# EAGLE schematic electrobassrev7_fix (EAGLE 9.6.2)

## Sheet 1 of 10
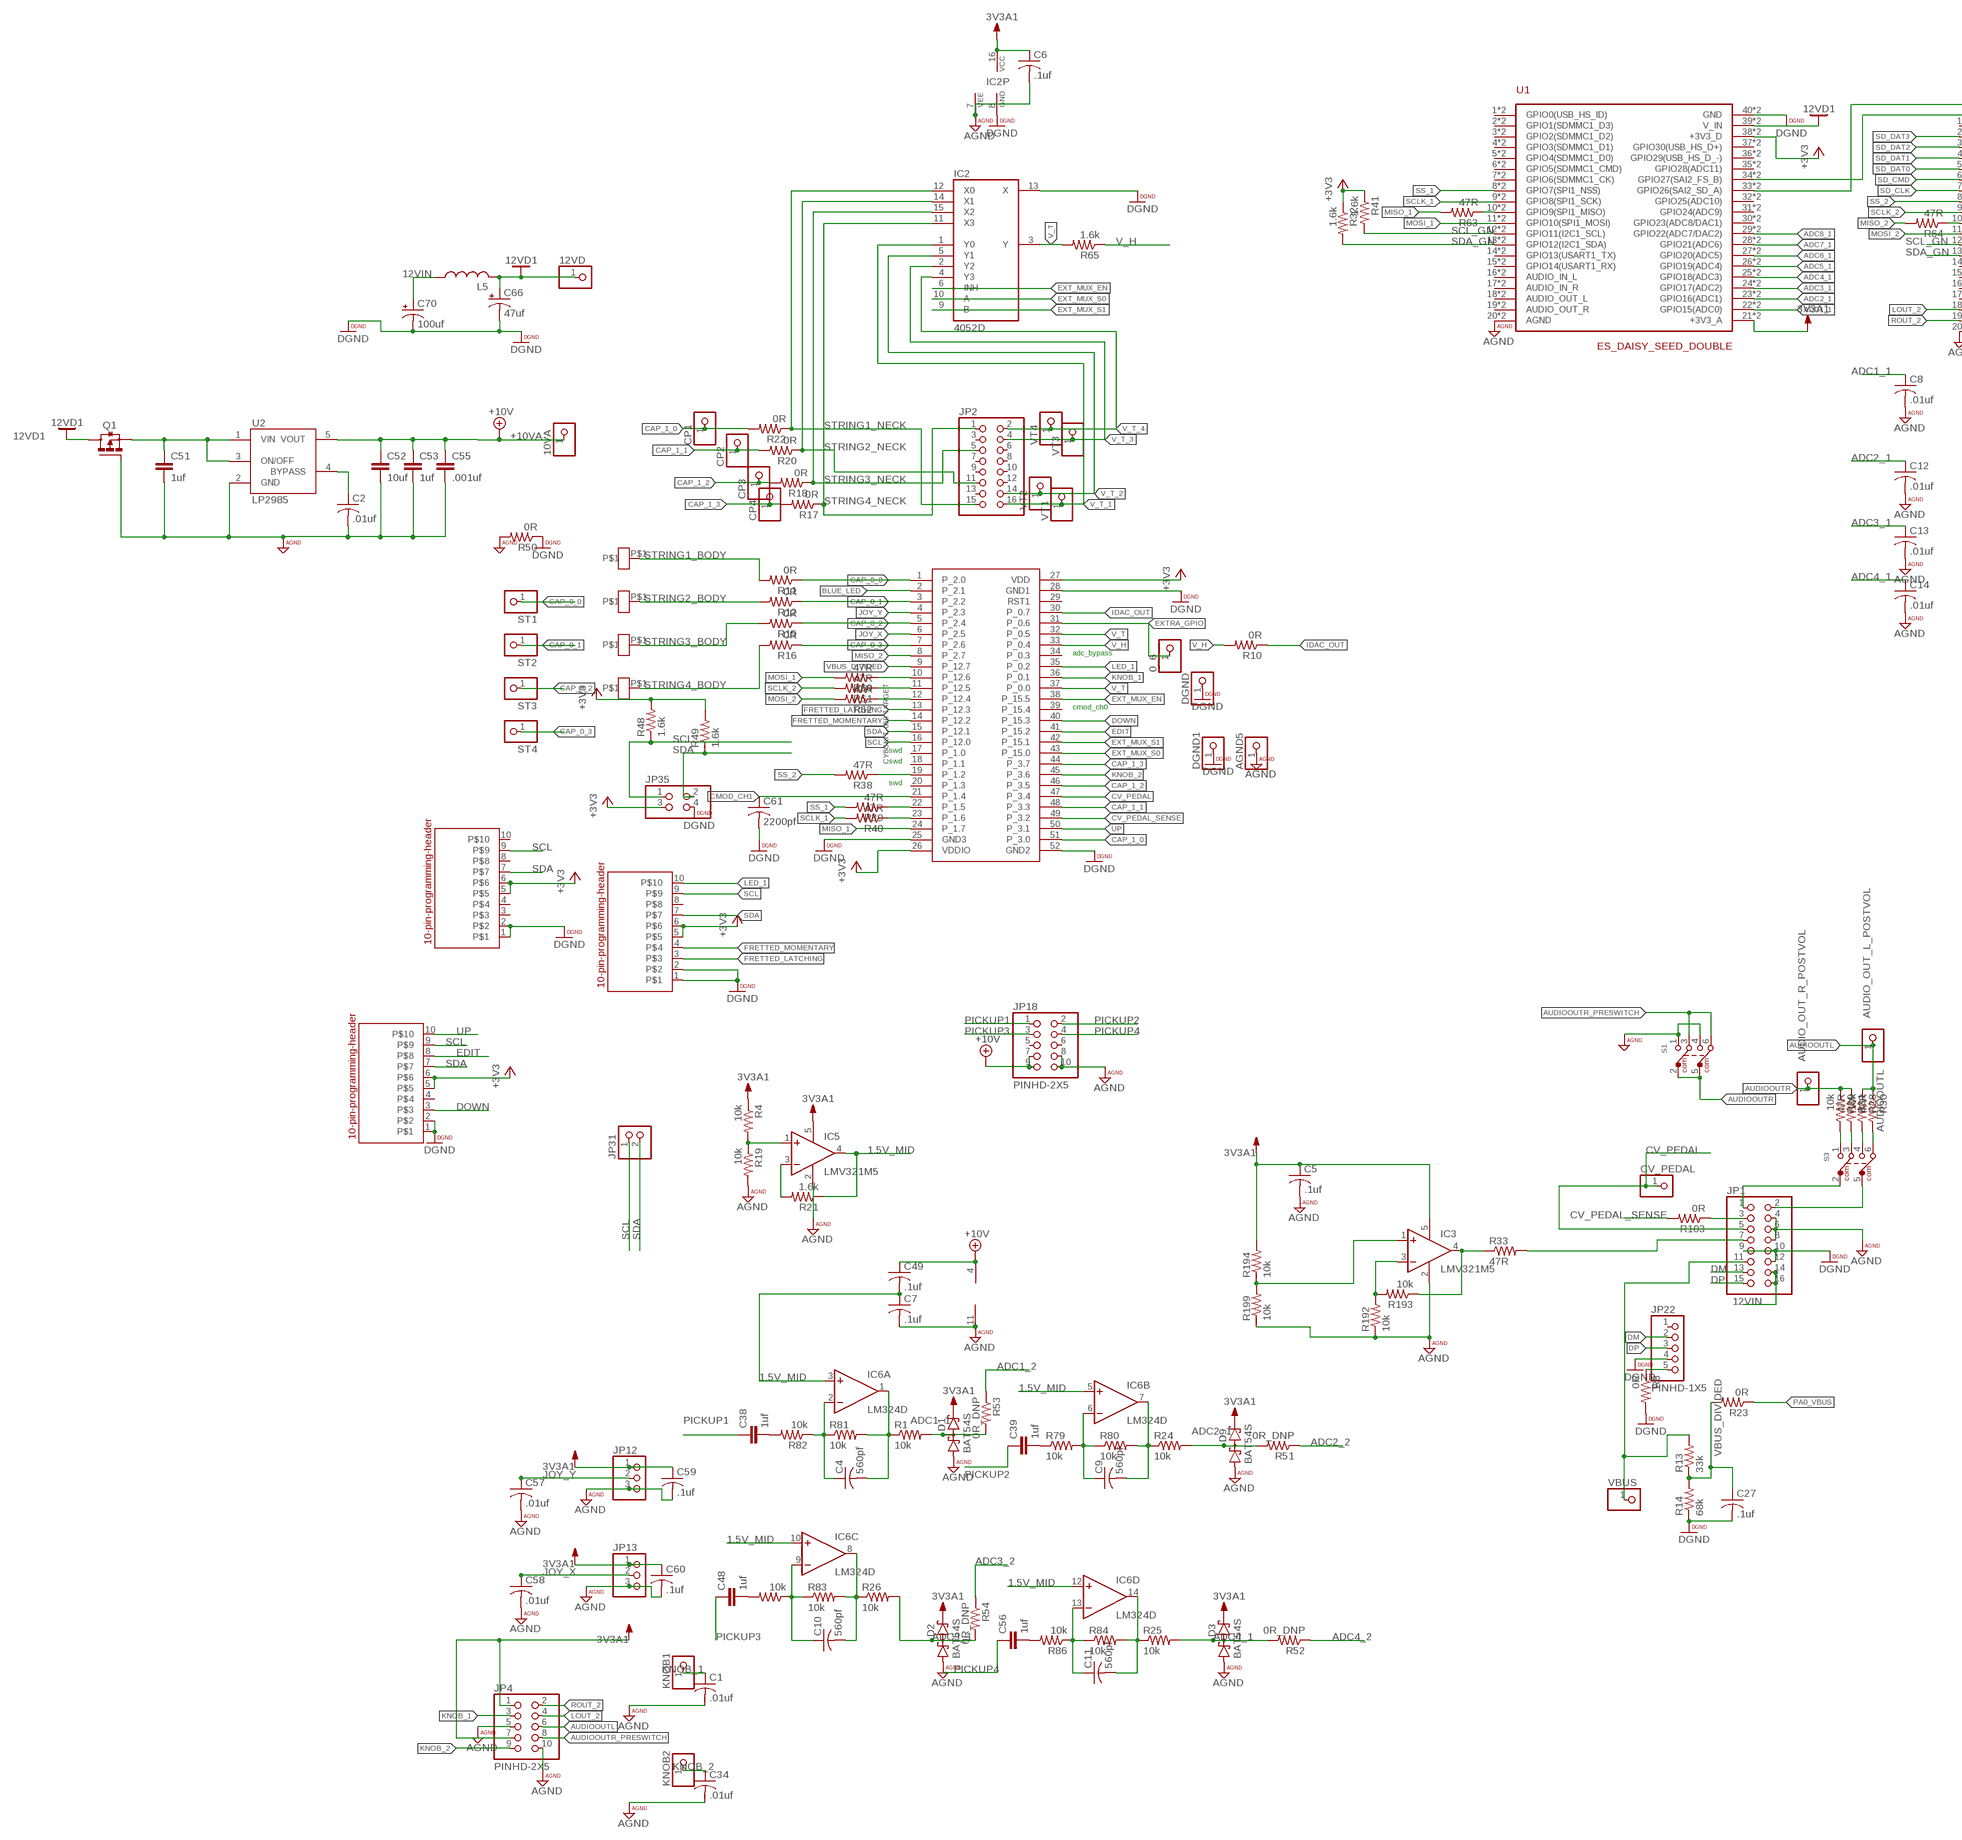
[diagram p0: schematic, sheet 1, part 1 of 2]
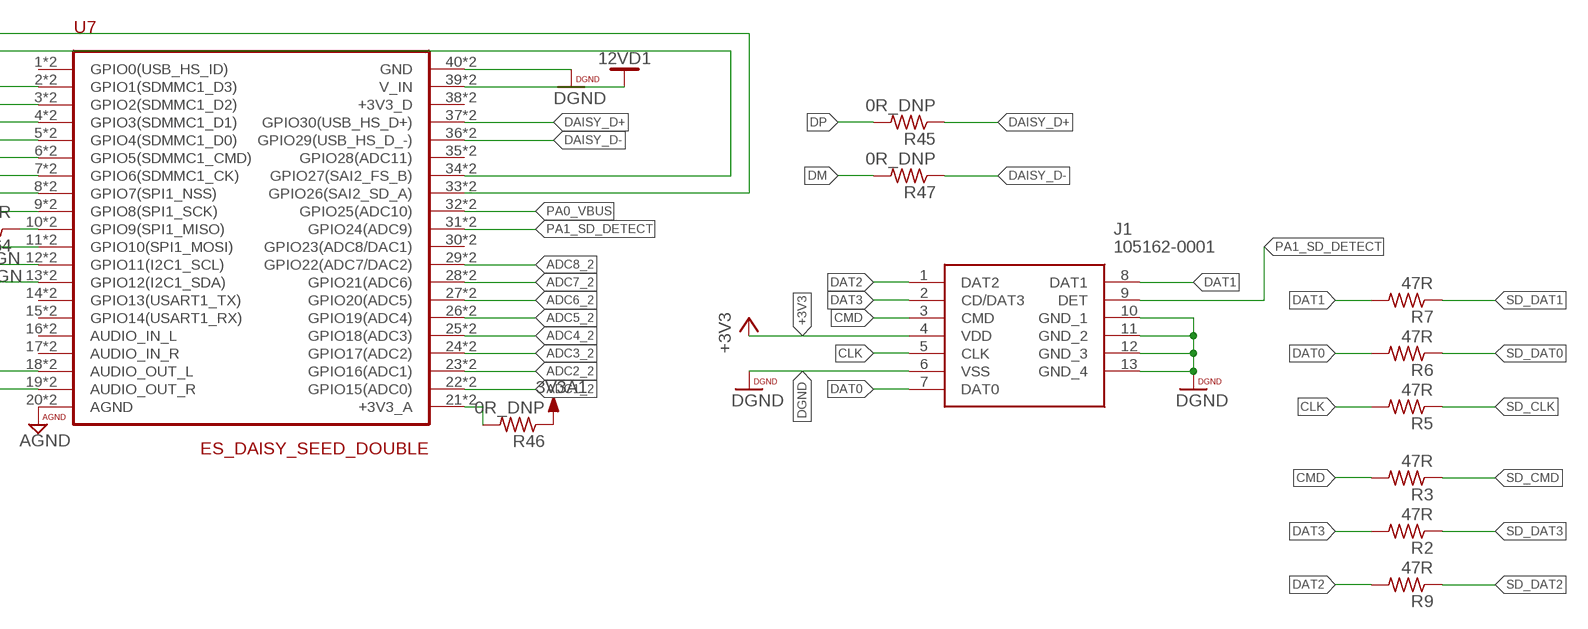
[diagram p1: schematic, sheet 1, part 2 of 2]

### Parts
0_6  PINHD-1X1  [1X01]
10VA  PINHD-1X1  [1X01]
12VD  PINHD-1X1  [1X01]
AGND5  PINHD-1X1  [1X01]
AUDIO_OUT_L_POSTVOL  PINHD-1X1  [1X01]
AUDIO_OUT_R_POSTVOL  PINHD-1X1  [1X01]
C1  .01uf  C-USC0603K  [C0603K]
C2  .01uf  C-USC0603K  [C0603K]
C4  560pf  C-USC0603K  [C0603K]
C5  .1uf  C-USC0603K  [C0603K]
C6  .1uf  C-USC0603K  [C0603K]
C7  .1uf  C-USC0603K  [C0603K]
C8  .01uf  C-USC0603K  [C0603K]
C9  560pf  C-USC0603K  [C0603K]
C10  560pf  C-USC0603K  [C0603K]
C11  560pf  C-USC0603K  [C0603K]
C12  .01uf  C-USC0603K  [C0603K]
C13  .01uf  C-USC0603K  [C0603K]
C14  .01uf  C-USC0603K  [C0603K]
C27  .1uf  C-USC0603K  [C0603K]
C34  .01uf  C-USC0603K  [C0603K]
C38  1uf  C-EUC0603  [C0603]
C39  1uf  C-EUC0603  [C0603]
C48  1uf  C-EUC0603  [C0603]
C49  .1uf  C-USC0603K  [C0603K]
C51  1uf  C-EUC0603  [C0603]
C52  10uf  C-EUC1206K  [C1206K]
C53  1uf  C-EUC0603  [C0603]
C55  .001uf  C-EUC0603  [C0603]
C56  1uf  C-EUC0603  [C0603]
C57  .01uf  C-USC0603K  [C0603K]
C58  .01uf  C-USC0603K  [C0603K]
C59  .1uf  C-USC0603K  [C0603K]
C60  .1uf  C-USC0603K  [C0603K]
C61  2200pf  C-USC0603K  [C0603K]
C66  47uf  CPOL-USE  [PANASONIC_E]
C70  100uf  CPOL-USF  [PANASONIC_F]
CP1  PINHD-1X1  [1X01]
CP2  PINHD-1X1  [1X01]
CP3  PINHD-1X1  [1X01]
CP4  PINHD-1X1  [1X01]
CV_PEDAL  PINHD-1X1  [1X01]
D1  BAT54S  [SOT23]
D2  BAT54S  [SOT23]
D3  BAT54S  [SOT23]
D9  BAT54S  [SOT23]
DGND  PINHD-1X1  [1X01]
DGND1  PINHD-1X1  [1X01]
IC2  4052D  [SO16]
IC3  LMV321M5  [SOT23-5]
IC5  LMV321M5  [SOT23-5]
IC6  LM324D  [SO14]
J1  105162-0001  [105162-0001]
JP1  PINHD-2X8  [2X08]
JP2  PINHD-2X8  [2X08]
JP4  PINHD-2X5  [2X05]
JP8  20021121  [20021121]
JP9  20021121  [20021121]
JP12  PINHD-1X3  [1X03]
JP13  PINHD-1X3  [1X03]
JP18  PINHD-2X5  [2X05]
JP22  PINHD-1X5  [1X05]
JP23  20021121  [20021121]
JP31  PINHD-1X2  [1X02]
JP35  PINHD-2X2  [2X02]
KNOB1  PINHD-1X1  [1X01]
KNOB2  PINHD-1X1  [1X01]
L5  L-US6000-XXX-RC  [6000-XXXX-RC]
Q1  DMP3099L  FDN360P  [SUPER-SOT3]
R1  10k  R-US_R0603  [R0603]
R2  47R  R-US_R0603  [R0603]
R3  47R  R-US_R0603  [R0603]
R4  10k  R-US_R0603  [R0603]
R5  47R  R-US_R0603  [R0603]
R6  47R  R-US_R0603  [R0603]
R7  47R  R-US_R0603  [R0603]
R8  0R  R-US_R0603  [R0603]
R9  47R  R-US_R0603  [R0603]
R10  0R  R-US_R0603  [R0603]
R11  0R  R-US_R0603  [R0603]
R12  0R  R-US_R0603  [R0603]
R13  33k  R-US_R0603  [R0603]
R14  68k  R-US_R0603  [R0603]
R15  0R  R-US_R0603  [R0603]
R16  0R  R-US_R0603  [R0603]
R17  0R  R-US_R0603  [R0603]
R18  0R  R-US_R0603  [R0603]
R19  10k  R-US_R0603  [R0603]
R20  0R  R-US_R0603  [R0603]
R21  1.6k  R-US_R0603  [R0603]
R22  0R  R-US_R0603  [R0603]
R23  0R  R-US_R0603  [R0603]
R24  10k  R-US_R0603  [R0603]
R25  10k  R-US_R0603  [R0603]
R26  10k  R-US_R0603  [R0603]
R28  10k  R-US_R0603  [R0603]
R29  10k  R-US_R0603  [R0603]
R30  47R  R-US_R0603  [R0603]
R31  47R  R-US_R0603  [R0603]
R32  1.6k  R-US_R0603  [R0603]
R33  47R  R-US_R0603  [R0603]
R38  47R  R-US_R0603  [R0603]
R39  47R  R-US_R0603  [R0603]
R40  47R  R-US_R0603  [R0603]
R41  1.6k  R-US_R0603  [R0603]
R45  0R_DNP  R-US_R0603  [R0603]
R46  0R_DNP  R-US_R0603  [R0603]
R47  0R_DNP  R-US_R0603  [R0603]
R48  1.6k  R-US_R0603  [R0603]
R49  1.6k  R-US_R0603  [R0603]
R50  0R  R-US_R0603  [R0603]
R51  0R_DNP  R-US_R0603  [R0603]
R52  0R_DNP  R-US_R0603  [R0603]
R53  0R_DNP  R-US_R0603  [R0603]
R54  0R_DNP  R-US_R0603  [R0603]
R60  47R  R-US_R0603  [R0603]
R61  47R  R-US_R0603  [R0603]
R62  47R  R-US_R0603  [R0603]
R63  47R  R-US_R0603  [R0603]
R64  47R  R-US_R0603  [R0603]
R65  1.6k  R-US_R0603  [R0603]
R79  10k  R-US_R0603  [R0603]
R80  10k  R-US_R0603  [R0603]
R81  10k  R-US_R0603  [R0603]
R82  10k  R-US_R0603  [R0603]
R83  10k  R-US_R0603  [R0603]
R84  10k  R-US_R0603  [R0603]
R85  10k  R-US_R0603  [R0603]
R86  10k  R-US_R0603  [R0603]
R103  0R  R-US_R0603  [R0603]
R192  10k  R-US_R0603  [R0603]
R193  10k  R-US_R0603  [R0603]
R194  10k  R-US_R0603  [R0603]
R199  10k  R-US_R0603  [R0603]
S1  452404020202  [452404020202]
S3  452404020202  [452404020202]
ST1  PINHD-1X1  [1X01]
ST2  PINHD-1X1  [1X01]
ST3  PINHD-1X1  [1X01]
ST4  PINHD-1X1  [1X01]
U1  ES_DAISY_SEED_DOUBLE  [ES_DAISY_SEED_DOUBLE]
U2  LP2985  LP2985AIM5-3.3  [SOT25]
U7  ES_DAISY_SEED_DOUBLE  [ES_DAISY_SEED_DOUBLE]
U$7  CY8CKIT-059_TARGET_3  [CY8CKIT-059_TARGET_3]
U$15  STRING_HOLDER  [STRING_HOLDER]
U$16  STRING_HOLDER  [STRING_HOLDER]
U$68  STRING_HOLDER  [STRING_HOLDER]
U$69  STRING_HOLDER  [STRING_HOLDER]
VBUS  PINHD-1X1  [1X01]
VT1  PINHD-1X1  [1X01]
VT2  PINHD-1X1  [1X01]
VT3  PINHD-1X1  [1X01]
VT4  PINHD-1X1  [1X01]

### Nets
1.5V_MID: C7.1 C49.2 IC5.4(OUT) IC6.3(A:+IN) IC6.5(B:+IN) IC6.10(C:+IN) IC6.12(D:+IN) R21.1
3V3A1: C5.1 C6.1 C59.1 C60.1 D1.2(C2) D2.2(C2) D3.2(C2) D9.2(C2) IC2.16(VCC) IC3.5(V+) IC5.5(V+) JP4.1 JP4.7 JP12.1 JP13.1 R4.1 R46.1 R194.2 U1.21(+3V3_A) U1.B21(+3V3_A)
3V3FORPEDAL: JP1.7 R33.2
12VD1: 12VD.1 C66.+ L5.2 Q1.3(D) U1.39(V_IN) U1.B39(V_IN) U7.39(V_IN) U7.B39(V_IN)
12VIN: C70.+ JP1.14 JP1.16 L5.1
+3V3: J1.4(VDD) JP8.5 JP8.6 JP9.5 JP9.6 JP23.5 JP23.6 JP35.3 R32.1 R41.1 R48.2 R49.2 U1.38(+3V3_D) U1.B38(+3V3_D) U$7.26(VDDIO) U$7.27(VDD)
+10V: 10VA.1 C49.1 C52.1 C53.1 C55.1 IC6.4(P:V+) JP18.7 JP18.9 U2.5(VOUT)
ADC1_1: C4.2 C8.1 D1.3(C1A2) IC6.1(A:OUT) R1.1 R1.2 R53.2 R81.2 U1.22(GPIO15(ADC0)) U1.B22(GPIO15(ADC0))
ADC1_2: R53.1 U7.22(GPIO15(ADC0)) U7.B22(GPIO15(ADC0))
ADC2_1: C9.2 C12.1 D9.3(C1A2) IC6.7(B:OUT) R24.1 R24.2 R51.2 R80.2 U1.23(GPIO16(ADC1)) U1.B23(GPIO16(ADC1))
ADC2_2: R51.1 U7.23(GPIO16(ADC1)) U7.B23(GPIO16(ADC1))
ADC3_1: C10.2 C13.1 D2.3(C1A2) IC6.8(C:OUT) R26.1 R26.2 R54.2 R83.2 U1.24(GPIO17(ADC2)) U1.B24(GPIO17(ADC2))
ADC3_2: R54.1 U7.24(GPIO17(ADC2)) U7.B24(GPIO17(ADC2))
ADC4_1: C14.1 D3.3(C1A2) R25.2 R52.2 U1.25(GPIO18(ADC3)) U1.B25(GPIO18(ADC3))
ADC4_2: R52.1 U7.25(GPIO18(ADC3)) U7.B25(GPIO18(ADC3))
ADC5_1: U1.26(GPIO19(ADC4)) U1.B26(GPIO19(ADC4))
ADC5_2: U7.26(GPIO19(ADC4)) U7.B26(GPIO19(ADC4))
ADC6_1: U1.27(GPIO20(ADC5)) U1.B27(GPIO20(ADC5))
ADC6_2: U7.27(GPIO20(ADC5)) U7.B27(GPIO20(ADC5))
ADC7_1: U1.28(GPIO21(ADC6)) U1.B28(GPIO21(ADC6))
ADC7_2: U7.28(GPIO21(ADC6)) U7.B28(GPIO21(ADC6))
ADC8_1: U1.29(GPIO22(ADC7/DAC2)) U1.B29(GPIO22(ADC7/DAC2))
ADC8_2: U7.29(GPIO22(ADC7/DAC2)) U7.B29(GPIO22(ADC7/DAC2))
AGND: AGND5.1 C1.2 C2.2 C5.2 C6.2 C7.2 C8.2 C12.2 C13.2 C14.2 C34.2 C51.2 C52.2 C53.2 C55.2 C57.2 C58.2 C59.2 C60.2 D1.1(A1) D2.1(A1) D3.1(A1) D9.1(A1) IC2.7(VEE) IC3.2(V-) IC5.2(V-) IC6.11(P:V-) JP1.4 JP1.6 JP1.8 JP4.5 JP4.10 JP12.3 JP13.3 JP18.8 JP18.10 Q1.1(G) R19.2 R50.2 R192.1 R199.1 S1.1 S1.4 U1.20(AGND) U1.B20(AGND) U2.2(GND) U7.20(AGND) U7.B20(AGND)
AUDIOOUTL: AUDIO_OUT_L_POSTVOL.1 JP4.6 R28.1 R30.1
AUDIOOUTR: AUDIO_OUT_R_POSTVOL.1 R29.1 R31.1 S1.2(COM) S1.5(COM1)
AUDIOOUTR_PRESWITCH: JP4.8 S1.3 S1.6
BLUE_LED: U$7.2(P_2.1)
BYPASS: C2.1 U2.4(BYPASS)
CAP_0_0: R11.1 ST1.1 U$7.1(P_2.0)
CAP_0_1: R12.1 ST2.1 U$7.3(P_2.2)
CAP_0_2: R15.1 ST3.1 U$7.5(P_2.4)
CAP_0_3: R16.1 ST4.1 U$7.7(P_2.6)
CAP_1_0: CP1.1 R22.2 U$7.51(P_3.0)
CAP_1_1: CP2.1 R20.2 U$7.48(P_3.3)
CAP_1_2: CP3.1 R18.2 U$7.46(P_3.5)
CAP_1_3: CP4.1 R17.2 U$7.44(P_3.7)
CLK: J1.5(CLK) R5.2
CMD: J1.3(CMD) R3.2
CMOD_CH1: C61.1 U$7.21(P_1.4)
CV_PEDAL: CV_PEDAL.1 JP1.5 U$7.47(P_3.4)
CV_PEDAL_SENSE: R103.2 U$7.49(P_3.2)
DAISY_D+: R45.1 U7.37(GPIO30(USB_HS_D+)) U7.B37(GPIO30(USB_HS_D+))
DAISY_D-: R47.1 U7.36(GPIO29(USB_HS_D_-)) U7.B36(GPIO29(USB_HS_D_-))
DAT0: J1.7(DAT0) R6.2
DAT1: J1.8(DAT1) R7.2
DAT2: J1.1(DAT2) R9.2
DAT3: J1.2(CD/DAT3) R2.2
DGND: C27.2 C61.2 C66.- C70.- DGND1.1 DGND.1 IC2.8(GND) IC2.13(X) J1.6(VSS) J1.10(GND_1) J1.11(GND_2) J1.12(GND_3) J1.13(GND_4) JP1.9 JP1.10 JP1.12 JP8.1 JP8.2 JP9.1 JP9.2 JP22.4 JP23.1 JP23.2 JP35.4 R8.2 R14.1 R50.1 U1.40(GND) U1.B40(GND) U7.40(GND) U7.B40(GND) U$7.25(GND3) U$7.28(GND1) U$7.52(GND2)
DM: JP1.13 JP22.2 R47.2
DOWN: JP9.3 U$7.40(P_15.3)
DP: JP1.15 JP22.3 R45.2
EDIT: JP9.8 U$7.41(P_15.2)
EXT_MUX_EN: IC2.6(INH) U$7.38(P_15.5)
EXT_MUX_S0: IC2.10(A) U$7.43(P_15.0)
EXT_MUX_S1: IC2.9(B) U$7.42(P_15.1)
EXTRA_GPIO: 0_6.1 U$7.31(P_0.6)
FRETTED_LATCHING: JP23.3 U$7.13(P_12.3)
FRETTED_MOMENTARY: JP23.4 U$7.14(P_12.2)
IDAC_OUT: R10.1 U$7.30(P_0.7)
JOY_X: C58.1 JP13.2 U$7.6(P_2.5)
JOY_Y: C57.1 JP12.2 U$7.4(P_2.3)
KNOB_1: C1.1 JP4.3 KNOB1.1 U$7.36(P_0.1)
KNOB_2: C34.1 JP4.9 KNOB2.1 U$7.45(P_3.6)
LED_1: JP23.10 U$7.35(P_0.2)
LOUT_2: JP4.4 U7.18(AUDIO_OUT_L) U7.B18(AUDIO_OUT_L)
MISO_1: R63.2 U$7.24(P_1.7)
MISO_1_P: R63.1 U1.10(GPIO9(SPI1_MISO)) U1.B10(GPIO9(SPI1_MISO))
MISO_2: R64.2 U$7.8(P_2.7)
MISO_2_P: R64.1 U7.10(GPIO9(SPI1_MISO)) U7.B10(GPIO9(SPI1_MISO))
MOSI_1: R60.2 U1.11(GPIO10(SPI1_MOSI)) U1.B11(GPIO10(SPI1_MOSI))
MOSI_1_P: R60.1 U$7.10(P_12.6)
MOSI_2: R62.2 U7.11(GPIO10(SPI1_MOSI)) U7.B11(GPIO10(SPI1_MOSI))
MOSI_2_P: R62.1 U$7.12(P_12.4)
N$1: JP1.3 R103.1
N$3: R29.2 S3.1
N$4: R28.2 S3.4
N$5: JP1.1 S3.2(COM)
N$6: JP1.2 S3.5(COM1)
N$7: U1.33(GPIO26(SAI2_SD_A)) U1.B33(GPIO26(SAI2_SD_A)) U7.33(GPIO26(SAI2_SD_A)) U7.B33(GPIO26(SAI2_SD_A))
N$8: U1.34(GPIO27(SAI2_FS_B)) U1.B34(GPIO27(SAI2_FS_B)) U7.34(GPIO27(SAI2_FS_B)) U7.B34(GPIO27(SAI2_FS_B))
N$9: R31.2 S3.3
N$10: R30.2 S3.6
N$11: IC3.4(OUT) R33.1 R193.1
N$17: JP22.5 R8.1
N$19: C38.2 R82.2
N$22: C39.2 R79.1
N$28: C48.2 R85.2
N$29: C56.2 R86.2
N$30: C4.1 IC6.2(A:-IN) R81.1 R82.1
N$33: C9.1 IC6.6(B:-IN) R79.2 R80.1
N$34: C11.1 IC6.13(D:-IN) R84.1 R86.1
N$35: C10.1 IC6.9(C:-IN) R83.1 R85.1
N$36: IC5.3(-IN) R21.2
N$37: IC5.1(+IN) R4.2 R19.1
N$45: R46.2 U7.21(+3V3_A) U7.B21(+3V3_A)
N$66: C11.2 IC6.14(D:OUT) R25.1 R84.2
N$101: C51.1 Q1.2(S) U2.1(VIN) U2.3(ON/OFF)
N$261: IC3.3(-IN) R192.2 R193.2
N$268: IC3.1(+IN) R194.1 R199.2
PA0_VBUS: R23.1 U7.32(GPIO25(ADC10)) U7.B32(GPIO25(ADC10))
PA1_SD_DETECT: J1.9(DET) U7.31(GPIO24(ADC9)) U7.B31(GPIO24(ADC9))
PICKUP1: C38.1 JP18.1
PICKUP2: C39.1 JP18.2
PICKUP3: C48.1 JP18.3
PICKUP4: C56.1 JP18.4
ROUT_2: JP4.2 U7.19(AUDIO_OUT_R) U7.B19(AUDIO_OUT_R)
SCL: JP8.9 JP9.9 JP23.9 JP31.1 JP35.1 R48.1 U$7.16(P_12.0)
SCL_GN: R41.2 U1.12(GPIO11(I2C1_SCL)) U1.B12(GPIO11(I2C1_SCL)) U7.12(GPIO11(I2C1_SCL)) U7.B12(GPIO11(I2C1_SCL))
SCLK_1: R40.2 U1.9(GPIO8(SPI1_SCK)) U1.B9(GPIO8(SPI1_SCK))
SCLK_1_P: R40.1 U$7.23(P_1.6)
SCLK_2: R61.2 U7.9(GPIO8(SPI1_SCK)) U7.B9(GPIO8(SPI1_SCK))
SCLK_2_P: R61.1 U$7.11(P_12.5)
SD_CLK: R5.1 U7.7(GPIO6(SDMMC1_CK)) U7.B7(GPIO6(SDMMC1_CK))
SD_CMD: R3.1 U7.6(GPIO5(SDMMC1_CMD)) U7.B6(GPIO5(SDMMC1_CMD))
SD_DAT0: R6.1 U7.5(GPIO4(SDMMC1_D0)) U7.B5(GPIO4(SDMMC1_D0))
SD_DAT1: R7.1 U7.4(GPIO3(SDMMC1_D1)) U7.B4(GPIO3(SDMMC1_D1))
SD_DAT2: R9.1 U7.3(GPIO2(SDMMC1_D2)) U7.B3(GPIO2(SDMMC1_D2))
SD_DAT3: R2.1 U7.2(GPIO1(SDMMC1_D3)) U7.B2(GPIO1(SDMMC1_D3))
SDA: JP8.7 JP9.7 JP23.7 JP31.2 JP35.2 R49.1 U$7.15(P_12.1)
SDA_GN: R32.2 U1.13(GPIO12(I2C1_SDA)) U1.B13(GPIO12(I2C1_SDA)) U7.13(GPIO12(I2C1_SDA)) U7.B13(GPIO12(I2C1_SDA))
SS_1: R39.2 U1.8(GPIO7(SPI1_NSS)) U1.B8(GPIO7(SPI1_NSS))
SS_1_P: R39.1 U$7.22(P_1.5)
SS_2: R38.2 U7.8(GPIO7(SPI1_NSS)) U7.B8(GPIO7(SPI1_NSS))
SS_2_P: R38.1 U$7.19(P_1.2)
STRING1_BODY: R11.2 U$16.P$1
STRING1_NECK: IC2.12(X0) JP2.15 R22.1
STRING2_BODY: R12.2 U$15.P$1
STRING2_NECK: IC2.14(X1) JP2.11 R20.1
STRING3_BODY: R15.2 U$68.P$1
STRING3_NECK: IC2.15(X2) JP2.5 R18.1
STRING4_BODY: R16.2 U$69.P$1
STRING4_NECK: IC2.11(X3) JP2.1 R17.1
UP: JP9.10 U$7.50(P_3.1)
V_H: R10.2 R65.1 U$7.33(P_0.4)
V_T: IC2.3(Y) R65.2 U$7.32(P_0.5) U$7.37(P_0.0)
V_T_1: IC2.1(Y0) JP2.16 VT1.1
V_T_2: IC2.5(Y1) JP2.14 VT2.1
V_T_3: IC2.2(Y2) JP2.4 VT3.1
V_T_4: IC2.4(Y3) JP2.2 VT4.1
VBUS: JP1.11 R13.2 VBUS.1
VBUS_DIVIDED: C27.1 R13.1 R14.2 R23.2 U$7.9(P_12.7)
Unconnected: JP2.3 JP2.6 JP2.7 JP2.8 JP2.9 JP2.10 JP2.12 JP2.13 JP8.3 JP8.4 JP8.8 JP8.10 JP9.4 JP18.5 JP18.6 JP22.1 JP23.8 U1.1(GPIO0(USB_HS_ID)) U1.2(GPIO1(SDMMC1_D3)) U1.3(GPIO2(SDMMC1_D2)) U1.4(GPIO3(SDMMC1_D1)) U1.5(GPIO4(SDMMC1_D0)) U1.6(GPIO5(SDMMC1_CMD)) U1.7(GPIO6(SDMMC1_CK)) U1.14(GPIO13(USART1_TX)) U1.15(GPIO14(USART1_RX)) U1.16(AUDIO_IN_L) U1.17(AUDIO_IN_R) U1.18(AUDIO_OUT_L) U1.19(AUDIO_OUT_R) U1.30(GPIO23(ADC8/DAC1)) U1.31(GPIO24(ADC9)) U1.32(GPIO25(ADC10)) U1.35(GPIO28(ADC11)) U1.36(GPIO29(USB_HS_D_-)) U1.37(GPIO30(USB_HS_D+)) U1.B1(GPIO0(USB_HS_ID)) U1.B2(GPIO1(SDMMC1_D3)) U1.B3(GPIO2(SDMMC1_D2)) U1.B4(GPIO3(SDMMC1_D1)) U1.B5(GPIO4(SDMMC1_D0)) U1.B6(GPIO5(SDMMC1_CMD)) U1.B7(GPIO6(SDMMC1_CK)) U1.B14(GPIO13(USART1_TX)) U1.B15(GPIO14(USART1_RX)) U1.B16(AUDIO_IN_L) U1.B17(AUDIO_IN_R) U1.B18(AUDIO_OUT_L) U1.B19(AUDIO_OUT_R) U1.B30(GPIO23(ADC8/DAC1)) U1.B31(GPIO24(ADC9)) U1.B32(GPIO25(ADC10)) U1.B35(GPIO28(ADC11)) U1.B36(GPIO29(USB_HS_D_-)) U1.B37(GPIO30(USB_HS_D+)) U7.1(GPIO0(USB_HS_ID)) U7.14(GPIO13(USART1_TX)) U7.15(GPIO14(USART1_RX)) U7.16(AUDIO_IN_L) U7.17(AUDIO_IN_R) U7.30(GPIO23(ADC8/DAC1)) U7.35(GPIO28(ADC11)) U7.38(+3V3_D) U7.B1(GPIO0(USB_HS_ID)) U7.B14(GPIO13(USART1_TX)) U7.B15(GPIO14(USART1_RX)) U7.B16(AUDIO_IN_L) U7.B17(AUDIO_IN_R) U7.B30(GPIO23(ADC8/DAC1)) U7.B35(GPIO28(ADC11)) U7.B38(+3V3_D) U$7.17(P_1.0) U$7.18(P_1.1) U$7.20(P_1.3) U$7.29(RST1) U$7.34(P_0.3) U$7.39(P_15.4)

### Notes on the sheet
- +10VA
- adc_bypass
- cmod_ch0
- swd
- swd
- swd

## Sheet 2 of 10
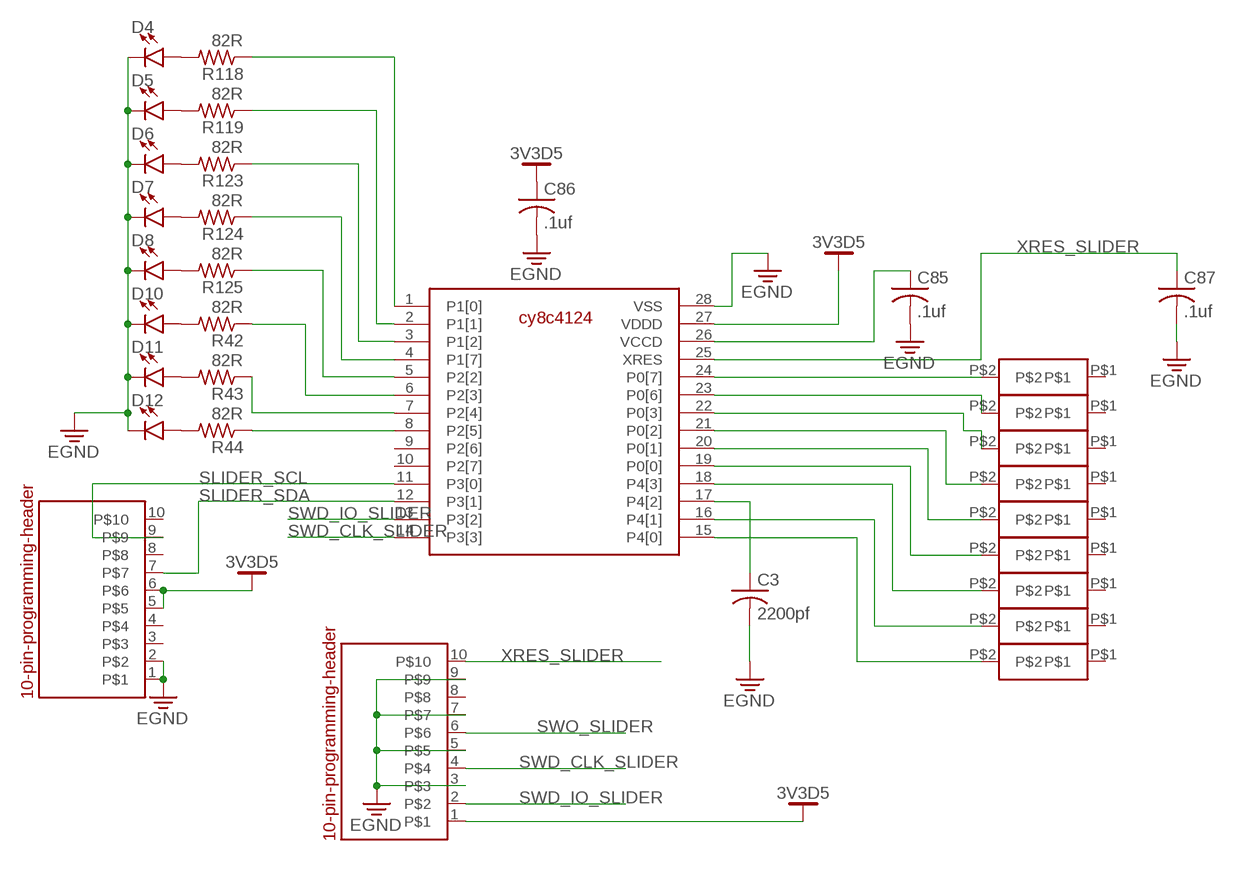
[diagram p2: schematic, sheet 2]

### Parts
C3  2200pf  C-USC0603K  [C0603K]
C85  .1uf  C-USC0603K  [C0603K]
C86  .1uf  C-USC0603K  [C0603K]
C87  .1uf  C-USC0603K  [C0603K]
D4  LED1206-BOTTOM  [LED-1206-BOTTOM]
D5  LED1206-BOTTOM  [LED-1206-BOTTOM]
D6  LED1206-BOTTOM  [LED-1206-BOTTOM]
D7  LED1206-BOTTOM  [LED-1206-BOTTOM]
D8  LED1206-BOTTOM  [LED-1206-BOTTOM]
D10  LED1206-BOTTOM  [LED-1206-BOTTOM]
D11  LED1206-BOTTOM  [LED-1206-BOTTOM]
D12  LED1206-BOTTOM  [LED-1206-BOTTOM]
IC18  CY8C4124  [SSOP28]
JP6  20021121  [20021121]
JP34  20021121  [20021121]
R42  82R  R-US_R0603  [R0603]
R43  82R  R-US_R0603  [R0603]
R44  82R  R-US_R0603  [R0603]
R118  82R  R-US_R0603  [R0603]
R119  82R  R-US_R0603  [R0603]
R123  82R  R-US_R0603  [R0603]
R124  82R  R-US_R0603  [R0603]
R125  82R  R-US_R0603  [R0603]
U$1  SLIDER_SEGMENT  [SLIDERS_SLIDER-SEGMENT3]
U$5  SLIDER_SEGMENT  [SLIDERS_SLIDER-SEGMENT3]
U$11  SLIDER_SEGMENT  [SLIDERS_SLIDER-SEGMENT3]
U$12  SLIDER_SEGMENT  [SLIDERS_SLIDER-SEGMENT3]
U$13  SLIDER_SEGMENT  [SLIDERS_SLIDER-SEGMENT3]
U$14  SLIDER_SEGMENT  [SLIDERS_SLIDER-SEGMENT3]
U$18  SLIDER_SEGMENT  [SLIDERS_SLIDER-SEGMENT3]
U$19  SLIDER_SEGMENT  [SLIDERS_SLIDER-SEGMENT3]
U$20  SLIDER_SEGMENT  [SLIDERS_SLIDER-SEGMENT3]

### Nets
3V3D5: C86.1 IC18.27(VDDD) JP6.5 JP6.6 JP34.1
EGND: C3.2 C85.2 C86.2 C87.2 D4.C D5.C D6.C D7.C D8.C D10.C D11.C D12.C IC18.28(VSS) JP6.1 JP6.2 JP34.3 JP34.5 JP34.7 JP34.9
N$2: D4.A R118.2
N$12: D5.A R119.2
N$13: D6.A R123.2
N$14: D7.A R124.2
N$15: D8.A R125.2
N$16: D10.A R42.2
N$18: D11.A R43.2
N$32: D12.A R44.2
N$38: IC18.8(P2[5]) R44.1
N$39: IC18.7(P2[4]) R43.1
N$40: IC18.6(P2[3]) R42.1
N$41: IC18.15(P4[0]) U$20.P$2
N$42: IC18.19(P0[0]) U$14.P$2
N$43: IC18.20(P0[1]) U$13.P$2
N$44: IC18.21(P0[2]) U$12.P$2
N$46: IC18.22(P0[3]) U$11.P$2
N$49: IC18.24(P0[7]) U$1.P$2
N$50: IC18.16(P4[1]) U$19.P$2
N$51: IC18.23(P0[6]) U$5.P$2
N$148: IC18.18(P4[3]) U$18.P$2
N$151: C85.1 IC18.26(VCCD)
N$152: IC18.1(P1[0]) R118.1
N$153: C3.1 IC18.17(P4[2])
N$154: IC18.2(P1[1]) R119.1
N$155: IC18.3(P1[2]) R123.1
N$156: IC18.4(P1[7]) R124.1
N$162: IC18.5(P2[2]) R125.1
SLIDER_SCL: IC18.11(P3[0]) JP6.9
SLIDER_SDA: IC18.12(P3[1]) JP6.7
SWD_CLK_SLIDER: IC18.14(P3[3]) JP34.4
SWD_IO_SLIDER: IC18.13(P3[2]) JP34.2
SWO_SLIDER: JP34.6
XRES_SLIDER: C87.1 IC18.25(XRES) JP34.10
Unconnected: IC18.9(P2[6]) IC18.10(P2[7]) JP6.3 JP6.4 JP6.8 JP6.10 JP34.8 U$1.P$1 U$5.P$1 U$11.P$1 U$12.P$1 U$13.P$1 U$14.P$1 U$18.P$1 U$19.P$1 U$20.P$1

## Sheet 3 of 10
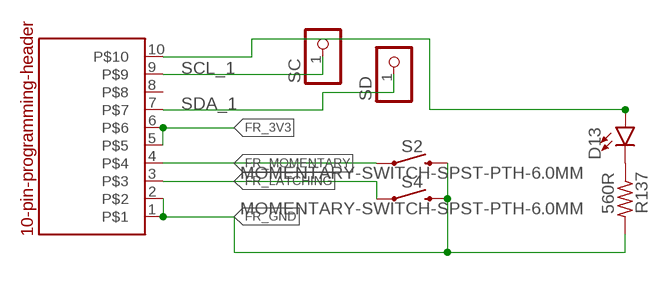
[diagram p3: schematic, sheet 3]

### Parts
D13  LED1206-BOTTOM  [LED-1206-BOTTOM]
JP24  20021121  [20021121]
R137  560R  R-US_R0603  [R0603]
S2  MOMENTARY-SWITCH-SPST-PTH-6.0MM  [TACTILE_SWITCH_PTH_6.0MM]
S4  MOMENTARY-SWITCH-SPST-PTH-6.0MM  [TACTILE_SWITCH_PTH_6.0MM]
SC  PINHD-1X1  [1X01]
SD  PINHD-1X1  [1X01]

### Nets
FR_3V3: JP24.5 JP24.6
FR_GND: JP24.1 JP24.2 R137.2 S2.3 S4.3
FR_LATCHING: JP24.3 S4.1
FR_MOMENTARY: JP24.4 S2.1
N$47: D13.A JP24.10
N$48: D13.C R137.1
SCL_1: JP24.9 SC.1
SDA_1: JP24.7 SD.1
Unconnected: JP24.8

## Sheet 4 of 10

## Sheet 5 of 10
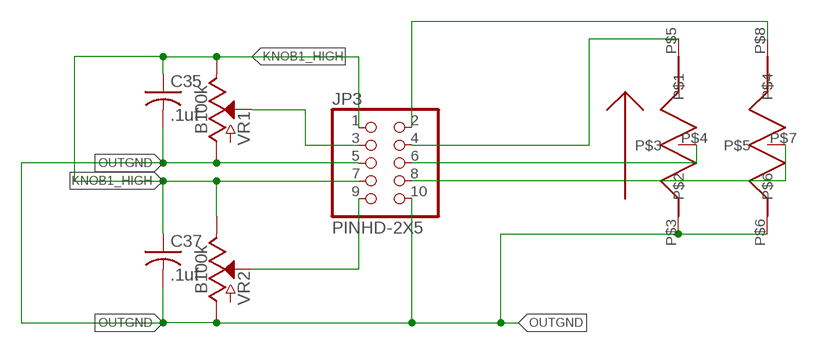
[diagram p4: schematic, sheet 5]

### Parts
C35  .1uf  C-USC0603K  [C0603K]
C37  .1uf  C-USC0603K  [C0603K]
JP3  PINHD-2X5  [2X05]
U$2  PN092  [PN092]
VR1  B100k  POTENTIOMETER-PTH-9MM-1/20W-20%-KIT  [POT-PTH-ALPS-KIT]
VR2  B100k  POTENTIOMETER-PTH-9MM-1/20W-20%-KIT  [POT-PTH-ALPS-KIT]

### Nets
KNOB1_HIGH: C35.1 C37.1 JP3.1 JP3.7 VR1.P$1(E) VR2.P$1(E)
N$25: JP3.3 VR1.P$2(S)
N$26: JP3.4 U$2.P$5
N$27: JP3.6 U$2.P$4
N$31: JP3.9 VR2.P$2(S)
N$52: JP3.8 U$2.P$7
N$53: JP3.2 U$2.P$8
OUTGND: C35.2 C37.2 JP3.5 JP3.10 U$2.P$3 U$2.P$6 VR1.P$3(A) VR2.P$3(A)

## Sheet 6 of 10
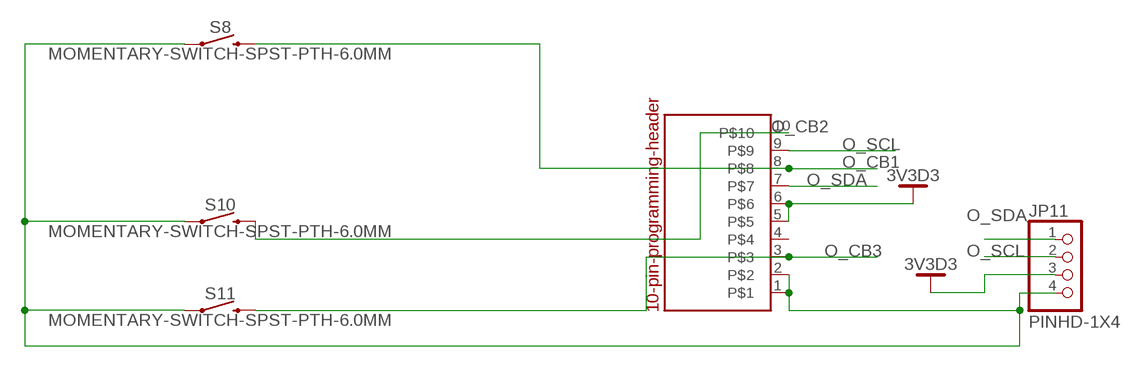
[diagram p5: schematic, sheet 6]

### Parts
JP10  20021121  [20021121]
JP11  PINHD-1X4  [1X04]
S8  MOMENTARY-SWITCH-SPST-PTH-6.0MM  [TACTILE_SWITCH_PTH_6.0MM]
S10  MOMENTARY-SWITCH-SPST-PTH-6.0MM  [TACTILE_SWITCH_PTH_6.0MM]
S11  MOMENTARY-SWITCH-SPST-PTH-6.0MM  [TACTILE_SWITCH_PTH_6.0MM]

### Nets
3V3D3: JP10.5 JP10.6 JP11.3
O_CB1: JP10.8 S8.3
O_CB2: JP10.10 S10.3
O_CB3: JP10.3 S11.3
O_GND: JP10.1 JP10.2 JP11.4 S8.1 S10.1 S11.1
O_SCL: JP10.9 JP11.2
O_SDA: JP10.7 JP11.1
Unconnected: JP10.4

## Sheet 7 of 10
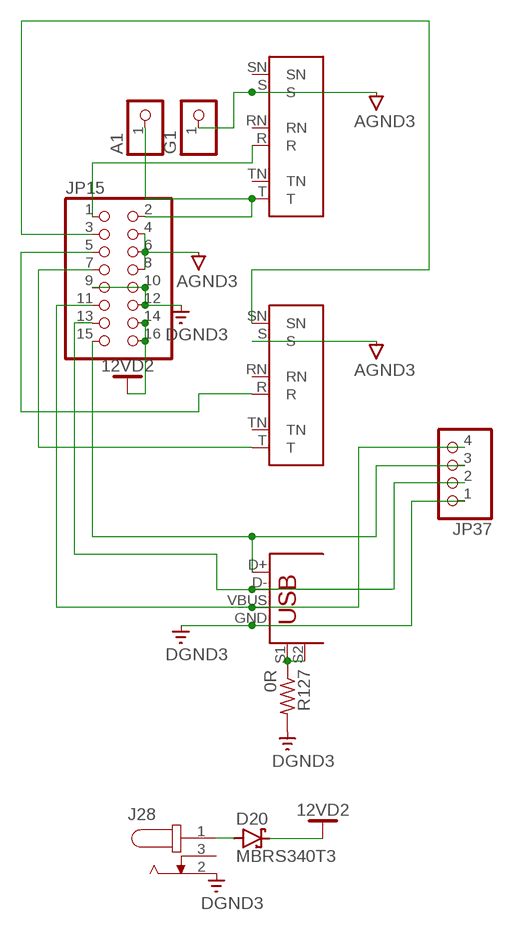
[diagram p6: schematic, sheet 7]

### Parts
A1  PINHD-1X1  [1X01]
D20  MBRS340T3  [SMC]
G1  PINHD-1X1  [1X01]
J28  PJ-066A  [CUI_PJ-066A]
JP15  PINHD-2X8  [2X08]
JP37  PINHD-1X4  [1X04]
R127  0R  R-US_R0603  [R0603]
X2  NRJ6HF2  [NRJ6HF2]
X3  NRJ6HF2  [NRJ6HF2]
X4  USB+SHIELD  [USB-B-PTH]

### Nets
12VD2: D20.C JP15.14 JP15.16
AGND3: G1.1 JP15.4 JP15.6 JP15.8 X2.S X3.S
DGND3: J28.2 JP15.9 JP15.10 JP15.12 JP37.1 R127.2 X4.GND
N$54: A1.1 JP15.2 X2.T
N$55: JP15.5 X3.R
N$56: JP15.7 X3.T
N$57: JP15.15 JP37.3 X4.D+
N$58: JP15.13 JP37.2 X4.D-
N$59: JP15.11 JP37.4 X4.VBUS
N$60: D20.A J28.1
N$61: JP15.1 X2.R
N$122: JP15.3 X3.SN
N$185: R127.1 X4.S1 X4.S2
Unconnected: J28.3 X2.RN X2.SN X2.TN X3.RN X3.TN

## Sheet 8 of 10
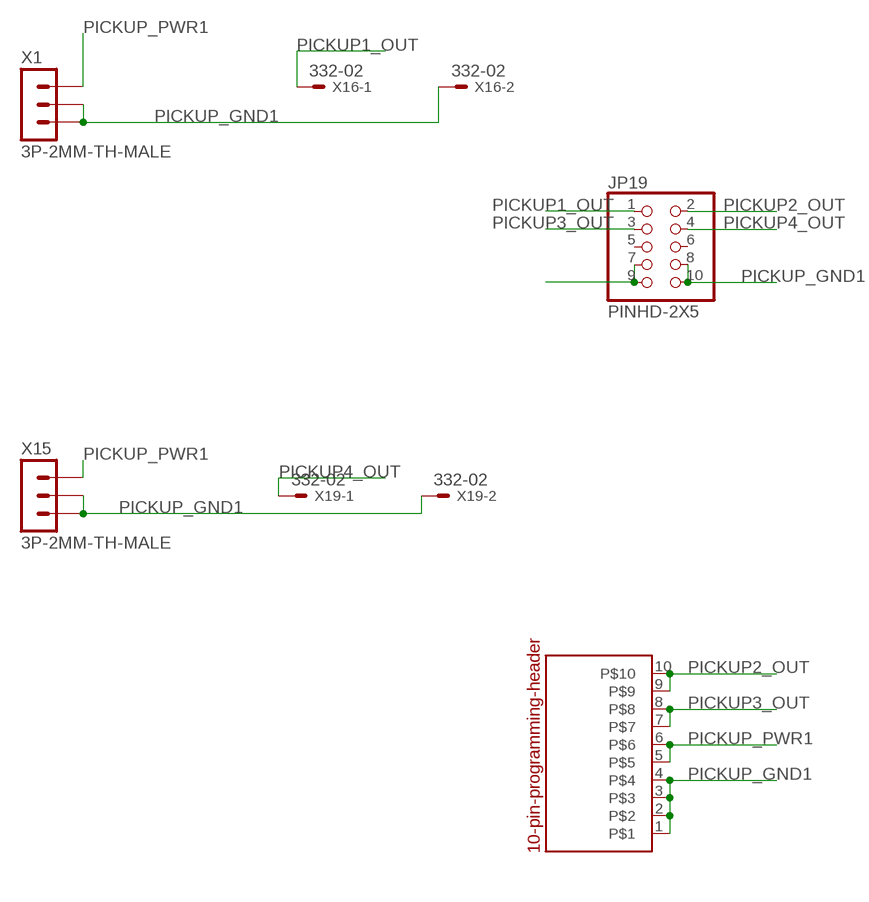
[diagram p7: schematic, sheet 8]

### Parts
JP19  PINHD-2X5  [2X05]
JP21  20021121  [20021121]
X1  3P-2MM-TH-MALE  [3P-2MM-TH]
X15  3P-2MM-TH-MALE  [3P-2MM-TH]
X16  332-02  [332-02]
X19  332-02  [332-02]

### Nets
PICKUP1_OUT: JP19.1 X16.1
PICKUP2_OUT: JP19.2 JP21.9 JP21.10
PICKUP3_OUT: JP19.3 JP21.7 JP21.8
PICKUP4_OUT: JP19.4 X19.1
PICKUP_GND1: JP19.8 JP19.10 JP21.1 JP21.2 JP21.3 JP21.4 X1.P$1 X1.P$2 X15.P$1 X15.P$2 X16.2 X19.2
PICKUP_PWR1: JP19.7 JP19.9 JP21.5 JP21.6 X1.P$3 X15.P$3
Unconnected: JP19.5 JP19.6

## Sheet 9 of 10
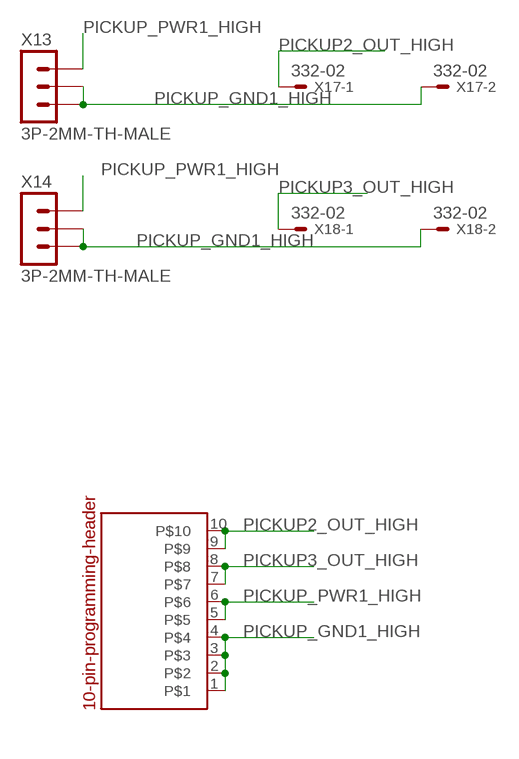
[diagram p8: schematic, sheet 9]

### Parts
JP20  20021121  [20021121]
X13  3P-2MM-TH-MALE  [3P-2MM-TH]
X14  3P-2MM-TH-MALE  [3P-2MM-TH]
X17  332-02  [332-02]
X18  332-02  [332-02]

### Nets
PICKUP2_OUT_HIGH: JP20.9 JP20.10 X17.1
PICKUP3_OUT_HIGH: JP20.7 JP20.8 X18.1
PICKUP_GND1_HIGH: JP20.1 JP20.2 JP20.3 JP20.4 X13.P$1 X13.P$2 X14.P$1 X14.P$2 X17.2 X18.2
PICKUP_PWR1_HIGH: JP20.5 JP20.6 X13.P$3 X14.P$3

## Sheet 10 of 10
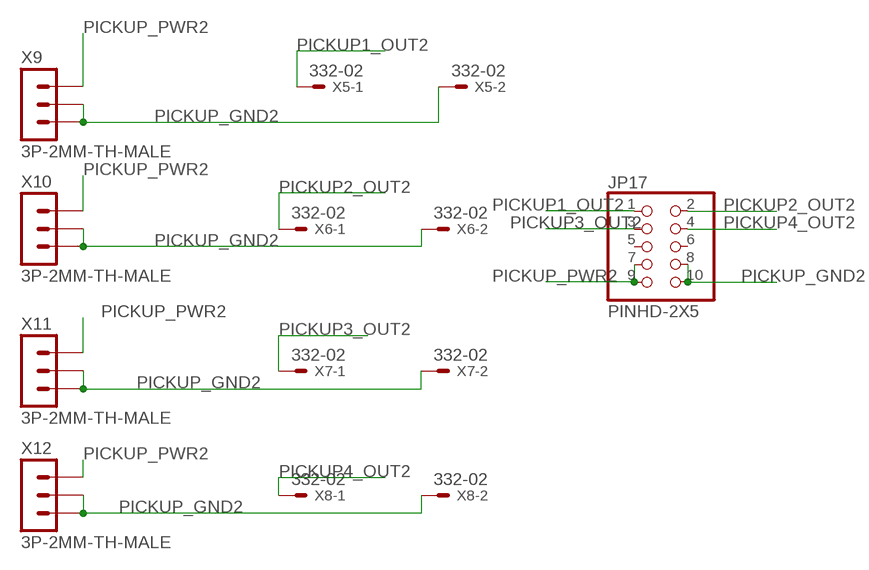
[diagram p9: schematic, sheet 10]

### Parts
JP17  PINHD-2X5  [2X05]
X5  332-02  [332-02]
X6  332-02  [332-02]
X7  332-02  [332-02]
X8  332-02  [332-02]
X9  3P-2MM-TH-MALE  [3P-2MM-TH]
X10  3P-2MM-TH-MALE  [3P-2MM-TH]
X11  3P-2MM-TH-MALE  [3P-2MM-TH]
X12  3P-2MM-TH-MALE  [3P-2MM-TH]

### Nets
PICKUP1_OUT2: JP17.1 X5.1
PICKUP2_OUT2: JP17.2 X6.1
PICKUP3_OUT2: JP17.3 X7.1
PICKUP4_OUT2: JP17.4 X8.1
PICKUP_GND2: JP17.8 JP17.10 X5.2 X6.2 X7.2 X8.2 X9.P$1 X9.P$2 X10.P$1 X10.P$2 X11.P$1 X11.P$2 X12.P$1 X12.P$2
PICKUP_PWR2: JP17.7 JP17.9 X9.P$3 X10.P$3 X11.P$3 X12.P$3
Unconnected: JP17.5 JP17.6

## Library data of the parts
0_6 10VA 12VD A1 AGND5 AUDIO_OUT_L_POSTVOL AUDIO_OUT_R_POSTVOL CP1-CP4 DGND DGND1 G1 KNOB1 KNOB2 SC SD ST1-ST4 VT1-VT4 = adafruit:PINHD-1X1: Pin header 1x1 for 0.1" spacing With round pins; PARTNO: *DNP
C1 C2 C4 C8-C14 C34 C57 C58 = adafruit:C-US: CAPACITOR, American symbol; PARTNO: CC0603KRX7R8BB103
C3 C61 = adafruit:C-US: CAPACITOR, American symbol; PARTNO: CC0603KRX7R9BB222
C5 C7 C27 C49 C85-C87 = rcl:C-US: CAPACITOR, American symbol; PARTNO: CC0603KRX7R8BB104
C6 C35 C37 C59 C60 = adafruit:C-US: CAPACITOR, American symbol; PARTNO: CC0603KRX7R8BB104
C38 C39 C48 C51 C53 C56 = rcl:C-EU: CAPACITOR, European symbol; PARTNO: UMK107BJ105KA-T
C52 = rcl:C-EU: CAPACITOR, European symbol; PARTNO: TMK316F106ZL-T
C55 = rcl:C-EU: CAPACITOR, European symbol; PARTNO: CC0603JRNPO8BN102
C66 = adafruit:CPOL-US: POLARIZED CAPACITOR, American symbol; PARTNO: EEE-1VA470P
C70 = adafruit:CPOL-US: POLARIZED CAPACITOR, American symbol; PARTNO: UUQ1E101MCL1GS
CV_PEDAL VBUS = pinhead:PINHD-1X1: PIN HEADER; PARTNO: *DNP
D1-D3 D9 = diode:BAT54S: Schottky Diodes Pin connection corrected 2011-05-04 Source: Fairchild .. BAT54.pdf; PARTNO: BAT54S-HF
D4-D8 D10-D13 = SparkFun-LED:LED: LED (Generic) Standard schematic elements and footprints for 5mm, 3mm, 1206, and 0603 sized LEDs. Generic LEDs with no color specified.; PARTNO: IN-S124BRA
D20 = diode:MBRS3*0T3: SCHOTTKY BARRIER RECTIFIER 3.0 AMPERES 20, 30, 40 VOLT Source: MBRS340T3-D.pdf; PARTNO: SS34
IC2 = 40xx:4052: Dual 4-channel ANALOG MULTIPLEXER; PARTNO: MC74HC4052ADR2G
IC3 IC5 = linear:LMV321?*: General Purpose, Low Voltage, Rail-to-Rail Output Operational Amplifiers Source: http://www.national.com/mpf/LM/LMV321.html http://www.national.com/dt/lmv_qual.pdf; PARTNO: NCV20091SN3T1G
IC6 = linear:LM324: OP AMP; PARTNO: LM324DR
IC18 = custom:CY8C4124; PARTNO: CY8C4124PVI-432
J1 = 105162-0001:105162-0001: Memory Card Connectors 1.45H MICRO SD HEADER WITH D/C PIN Source: Datasheet <http://www.molex.com/webdocs/datasheets/pdf/en-us//1051620001_MEMORY_CARD_SOCKET.pdf> Check prices <https://pricing.snapeda.com/parts/1051620001/Molex/view-part?ref=eda>; AVAILABILITY: In Stock; DESCRIPTION: 9 (8 + 1) Position Card Connector Secure Digital - microSD™ Surface Mount, Right Angle Gold; MF: Molex; MP: 1051620001; PACKAGE: None; PARTNO: 1051620001; PRICE: None; PURCHASE-URL: https://pricing.snapeda.com/search/part/1051620001/?ref=eda
J28 = PJ-066A:PJ-066A: 24 VDC 5 A Right Angle Through Hole 2 Conductors 3 Contacts Male Power Jack; MANUFACTURER: CUI INC; PARTNO: PJ-066A; PARTREV: 1.02; STANDARD: Manufacturer recommendations
JP1 JP2 JP15 = pinhead:PINHD-2X8: PIN HEADER; PARTNO: SBH11-PBPC-D08-ST-BK
JP3 JP4 JP17-JP19 = Connector:PINHD-2X5: PIN HEADER; CATEGORY: CONNECTOR; PARTNO: 3020-10-0100-00; SUB-CATEGORY: PIN-HEADER
JP6 JP8-JP10 JP20 JP21 JP23 JP24 JP34 = custom:20021121; PARTNO: 3221-10-0300-00
JP11 = Connector:PINHD-1X4: PIN HEADER; CATEGORY: CONNECTOR; PARTNO: *DNP; SUB-CATEGORY: PIN-HEADER
JP12 JP13 = adafruit:PINHD-1X3: PIN HEADER; PARTNO: *DNP
JP22 = Connector:PINHD-1X5: PIN HEADER; CATEGORY: CONNECTOR; PARTNO: *DNP; SUB-CATEGORY: PIN-HEADER
JP31 = pinhead:PINHD-1X2: PIN HEADER; PARTNO: *DNP
JP35 = pinhead:PINHD-2X2: PIN HEADER; PARTNO: *DNP
JP37 = pinhead:PINHD-1X4: PIN HEADER; PARTNO: *DNP
L5 = rcl:L-US: INDUCTOR, American symbol; PARTNO: RLB9012-100KL
Q1 = transistor-power:FDN360P: Single P-Channel, PowerTrench (R) MOSFET Source: http://www.fairchildsemi.com/ds/FD/FDN360P.pdf; PARTNO: DMP3125L-7
R1 R24-R26 R80 R81 R83 R84 = adafruit:R-US_: RESISTOR, American symbol; PARTNO: ESR03EZPF2002
R2 R3 R5-R7 R9 R38-R40 R60-R64 = rcl:R-US_: RESISTOR, American symbol; PARTNO: RC0603JR-0747RL; SPICEPREFIX: R
R4 R19 R192-R194 R199 = Resistor:R-US_: RESISTOR, American symbol; PARTNO: ESR03EZPF1002
R8 R10-R12 R15-R18 R20 R22 R23 R50 R103 R127 = adafruit:R-US_: RESISTOR, American symbol; PARTNO: CRCW06030000Z0EAHP
R13 = rcl:R-US_: RESISTOR, American symbol; PARTNO: ESR03EZPJ333
R14 = rcl:R-US_: RESISTOR, American symbol; PARTNO: CRCW060368K0FKEAHP
R21 R32 R41 R48 R49 R65 = adafruit:R-US_: RESISTOR, American symbol; PARTNO: ESR03EZPJ152
R28 R29 R79 R82 R85 R86 = adafruit:R-US_: RESISTOR, American symbol; PARTNO: ESR03EZPF1002
R30 R31 R33 = adafruit:R-US_: RESISTOR, American symbol; PARTNO: RC0603JR-0747RL
R42-R44 R118 R119 R123-R125 = adafruit:R-US_: RESISTOR, American symbol; PARTNO: RC0603JR-0782RL
R45-R47 R51-R54 = adafruit:R-US_: RESISTOR, American symbol; PARTNO: *DNP
R137 = Resistor:R-US_: RESISTOR, American symbol; PARTNO: ESR03EZPF5600
S1 S3 = Wurth_Switch_WS-SLTV:452404020202: WS-SLTV THT Mini Slide Switch, Same Side Connection 9.0x3.5 mm Properties Actuator Material:PA9T Actuator Flammability Rating:UL94 HB Actuator Color:Black Frame Material:LCP Frame Flammability Rating:UL94 V-0 Frame Color:Black Contact Material:Copper Alloy Contact Plating:Silver Terminal Material:Copper Alloy Terminal Plating:Silver Schematic:DPDT Switching Function:On-On Connection Type:Same Side Connection Operating Temperature:-40 up to +85 °C Qty.:200 Material Properties Cover Material :Stainless Steel Mechanical Properties Electrical Life:2000 Steps Switching Function:On-On Connection Type:Same Side Connection Packaging Properties Packaging :Bulk <https://www.we-online.com/catalog/media/o107346v209%20Family_WS-SLTV_452404020202.jpg> Details see: https://www.we-online.com/catalog/en/SLTV_9X3_5_THT/ Updated by yingchun,Shan;2020-02-24 2020(C) Würth Elektronik; DATASHEET-URL: https://www.we-online.com/catalog/datasheet/452404020202.pdf; PACKAGING: Bulk; PART-NUMBER: 452404020202; PARTNO: 452404020202; QTY: 200
S2 S4 S8 S10 S11 = SparkFun-Switches:MOMENTARY-SWITCH-SPST: Momentary Switch (Pushbutton) - SPST Normally-open (NO) SPST momentary switches (buttons, pushbuttons). Variants PTH-12MM - 12mm square, through-hole Momentary Pushbutton Switch - 12mm Square <https://www.sparkfun.com/products/9190> (COM-09190) PTH-6.0MM, PTH-6.0MM-KIT - 6.0mm square, through-hole Mini Pushbutton Switch <https://www.sparkfun.com/products/97> (COM-00097) KIT package intended for soldering kit's - only one side of pads' copper is exposed. PTH-RIGHT-ANGLE-KIT - Right-angle, through-hole Right Angle Tactile Button <https://www.sparkfun.com/products/10791> - Used on SparkFun BigTime Watch Kit <https://www.sparkfun.com/products/11734> SMD-12MM - 12mm square, surface-mount Tactile Button - SMD (12mm) <https://www.sparkfun.com/products/12993> (COM-12993) Used on SparkFun PicoBoard <https://www.sparkfun.com/products/11888> SMD-4.5MM - 4.5mm Square Trackball Switch Used on SparkFun Blackberry Trackballer Breakout <https://www.sparkfun.com/products/13169> SMD-4.6MMX2.8MM - 4.60mm x 2.80mm, surface mount Used on SparkFun SAMD21 Mini Breakout <https://www.sparkfun.com/products/13664> SMD-5.2MM, SMD-5.2-REDUNDANT - 5.2mm square, surface-mount Mini Pushbutton Switch - SMD <https://www.sparkfun.com/products/8720> (COM-08720) Used on Arduino Pro Mini <https://www.sparkfun.com/products/11114> REDUNDANT package connects both switch circuits together SMD-6.0X3.5MM - 6.0 x 3.5mm, surface mount Momentary Reset Switch SMD <https://www.sparkfun.com/products/8229> (COM-08229) SMD-6.2MM-TALL - 6.2mm square, surface mount Tactile Button - SMD (6mm) <https://www.sparkfun.com/products/12992> Used on SparkFun Digital Sandbox <https://www.sparkfun.com/products/12651> SMD-RIGHT-ANGLE - Right-angle, surface mount Used on SparkFun Block for Intel® Edison - Arduino <https://www.sparkfun.com/products/13036>; PARTNO: TL1105SPF160Q; PROD_ID: SWCH-08441; SF_SKU: COM-00097
U1 U7 = Electrosmith_Boards:ES_DAISY_SEED; PARTNO: *DNP
U2 = LP2985:LP2985: LP2985-N Micropower 150 mA Low-Noise Ultra Low-Dropout Regulator; PARTNO: LP2985-10DBVR
U$1 U$5 U$11-U$14 U$18-U$20 = manta_rev3_5:SLIDER_SEGMENT; PARTNO: *DNP
U$2 = custom:PN092; PARTNO: P0925N-FA15AR100K
U$7 = CY8KIT-059:CY8CKIT-059_TARGET_3: CY8CKIT-059 Target This device exposes the pins of the target section of the CY8CKIT-059. This footprint is the one that you will use most of the times, since only the pins of the target section will be then soldered to your PCB.; PARTNO: *DNP
U$15 U$16 U$68 U$69 = custom:STRING_HOLDER; PARTNO: *DNP
VR1 VR2 = SparkFun-Resistors:POTENTIOMETER: Potentiometer (Pot) Three-terminal potentiometers, with an adjustable wiper and two adjustable resistors. A pot can be used to create a configurable voltage divider, or as a variable resistor. Variants ALPS_POT and ALPS_POT_KIT - PTH, breadboard compatible, 9mm square pots Rotary Potentiometer - Linear (10k ohm) <https://www.sparkfun.com/products/9288> (COM-09288) The KIT variant exposes copper on only one side of the PTH pad, so the part can only be assembled on one side of the PCB. Useful for beginner soldering kits.; PARTNO: P0915N-FC15BR100K; PROD_ID: RES-09177; SF_SKU: COM-09288; VALUE: 10k
X1 X9-X15 = CYCFI_Con:3P-2MM-TH-MALE; PARTNO: *DNP
X2 X3 = custom:NRJ6HF2; PARTNO: NRJ6HM-1
X4 = SparkFun-Connectors:USB+SHIELD: USB+Shield USB connector with shield pins connectable; PARTNO: PRT-00139
X5-X8 X16-X19 = con-garry:332-02: 2 Pin - 2mm Dual Row Source: www.mpe-connector.de / garry_shortform_2012.pdf; PARTNO: *DNP